# EAGLE design Volume Button LED 5 (EAGLE 7.3.0)

## Sheet 1 of 2
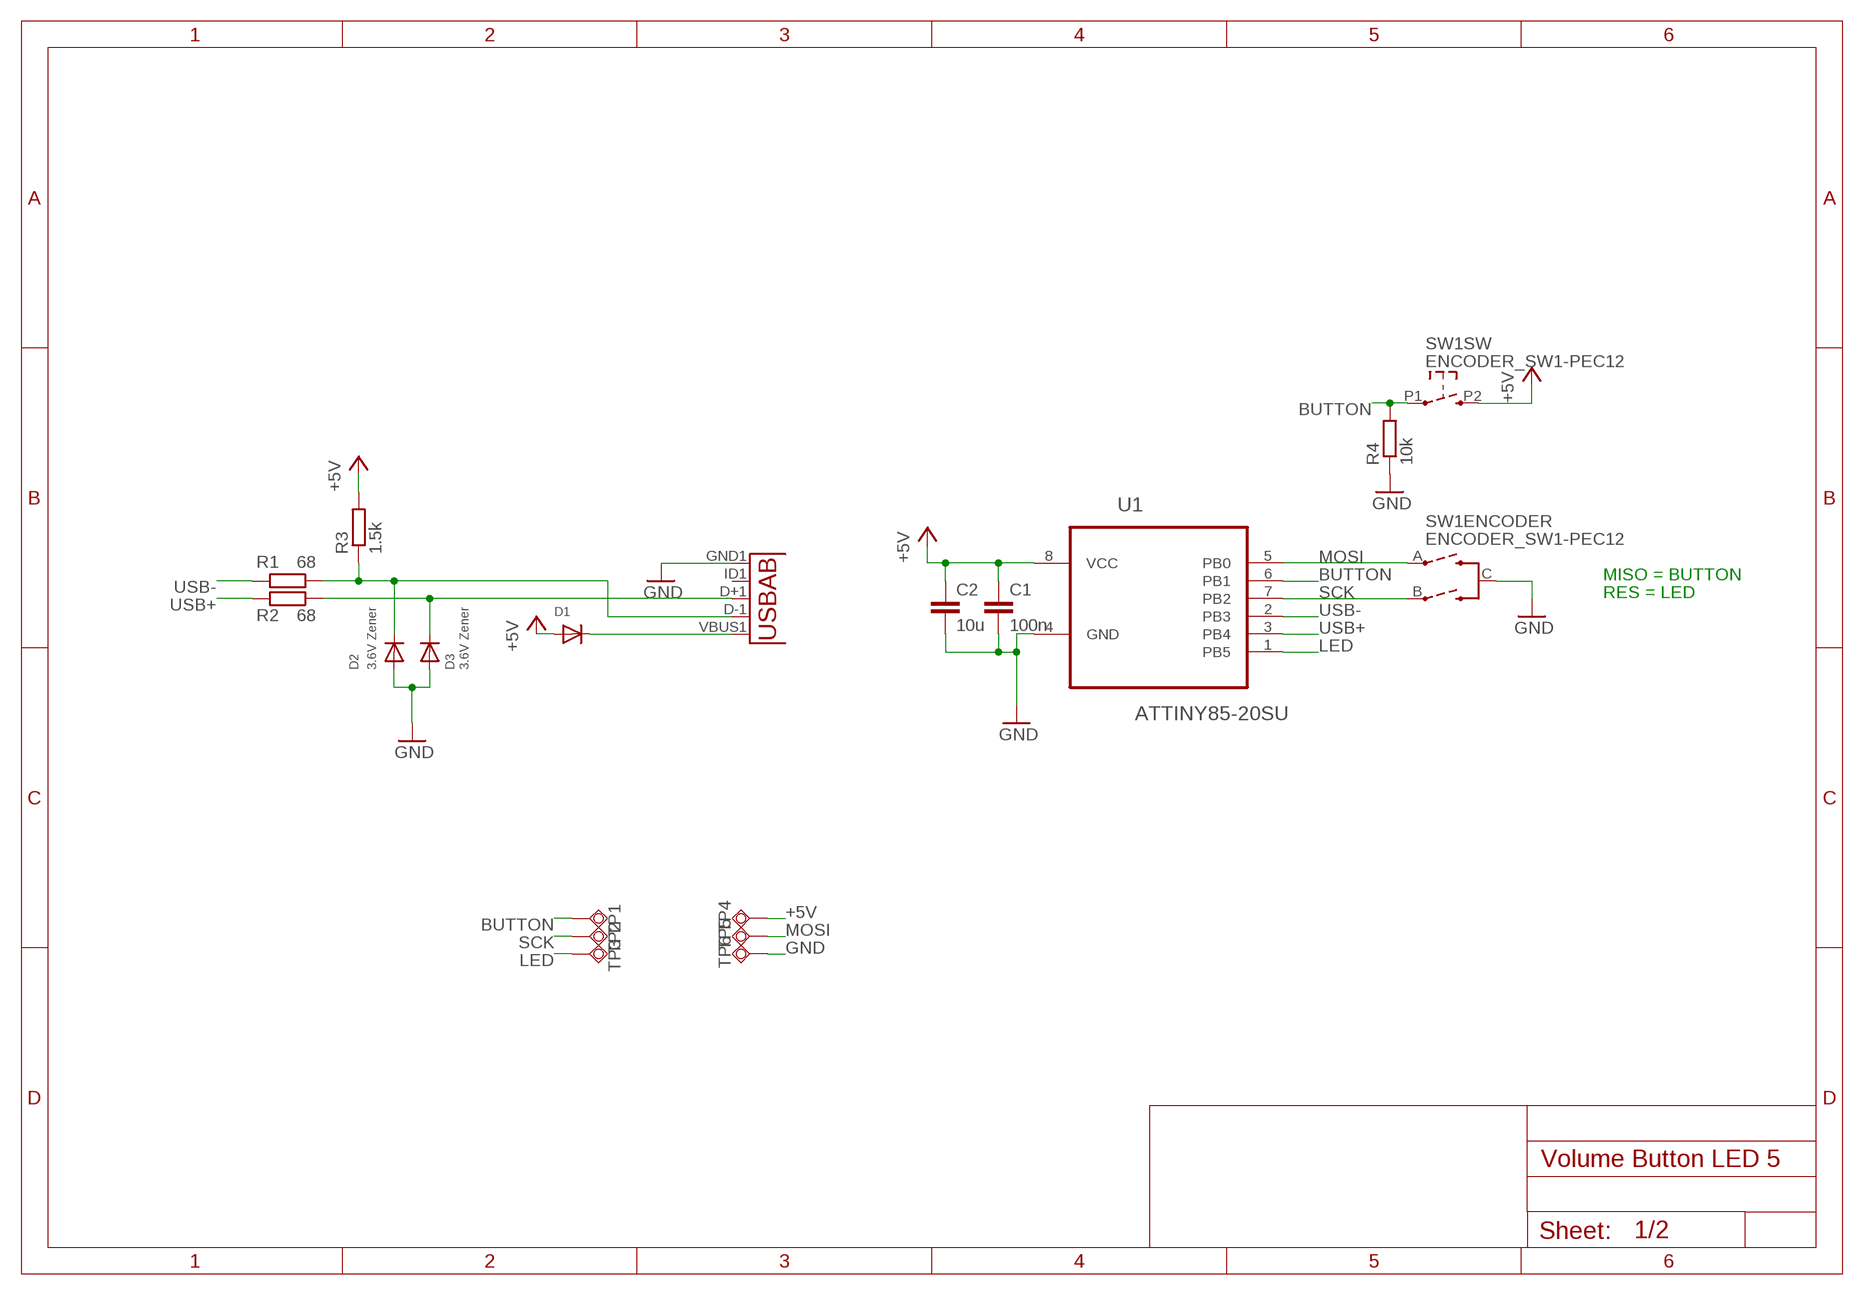
[diagram p0: schematic, sheet 1]

### Parts
C1  100n  C-EUC0805  [C0805]
C2  10u  C-EUC0805  [C0805]
D1  DIODESOD-123  [SOD-123]
D2  3.6V Zener  DIODESOD-323F  [SOD-323F]
D3  3.6V Zener  DIODESOD-323F  [SOD-323F]
R1  68  R-EU_R0603  [R0603]
R2  68  R-EU_R0603  [R0603]
R3  1.5k  R-EU_R0603  [R0603]
R4  10k  R-EU_R0805  [R0805]
SW1  ENCODER_SW1-PEC12  [PEC12_INCREMENTAL_ENCODER]
TP1  TPSQTP15R  [TP15R]
TP2  TPSQTP15R  [TP15R]
TP3  TPSQTP15R  [TP15R]
TP4  TPSQTP15R  [TP15R]
TP5  TPSQTP15R  [TP15R]
TP6  TPSQTP15R  [TP15R]
U1  ATTINY85-20SU  [SOIC127P798X216-8N]
U2  USB""  [USB-MICRO-SMD]

### Nets
+5V: C1.1 C2.1 D1.A R3.2 SW1.P2 TP4.TP U1.8(VCC) ; also sheet 2
BUTTON: R4.2 SW1.P1 TP1.TP U1.6(PB1)
GND: C1.2 C2.2 D2.A D3.A R4.1 SW1.C(ENCODER:C) TP6.TP U1.4(GND) U2.GND1(GND) ; also sheet 2
LED: TP3.TP U1.1(PB5) ; also sheet 2
MOSI: SW1.A(ENCODER:A) TP5.TP U1.5(PB0)
N$2: D1.C U2.VBUS1(VBUS)
N$3: D2.C R1.1 R3.1 U2.D-1(D-)
N$4: D3.C R2.1 U2.D+1(D+)
SCK: SW1.B(ENCODER:B) TP2.TP U1.7(PB2)
USB+: R2.2 U1.3(PB4)
USB-: R1.2 U1.2(PB3)
Unconnected: U2.ID1(USBID)

### Notes on the sheet
- MISO = BUTTON
- RES = LED

## Sheet 2 of 2
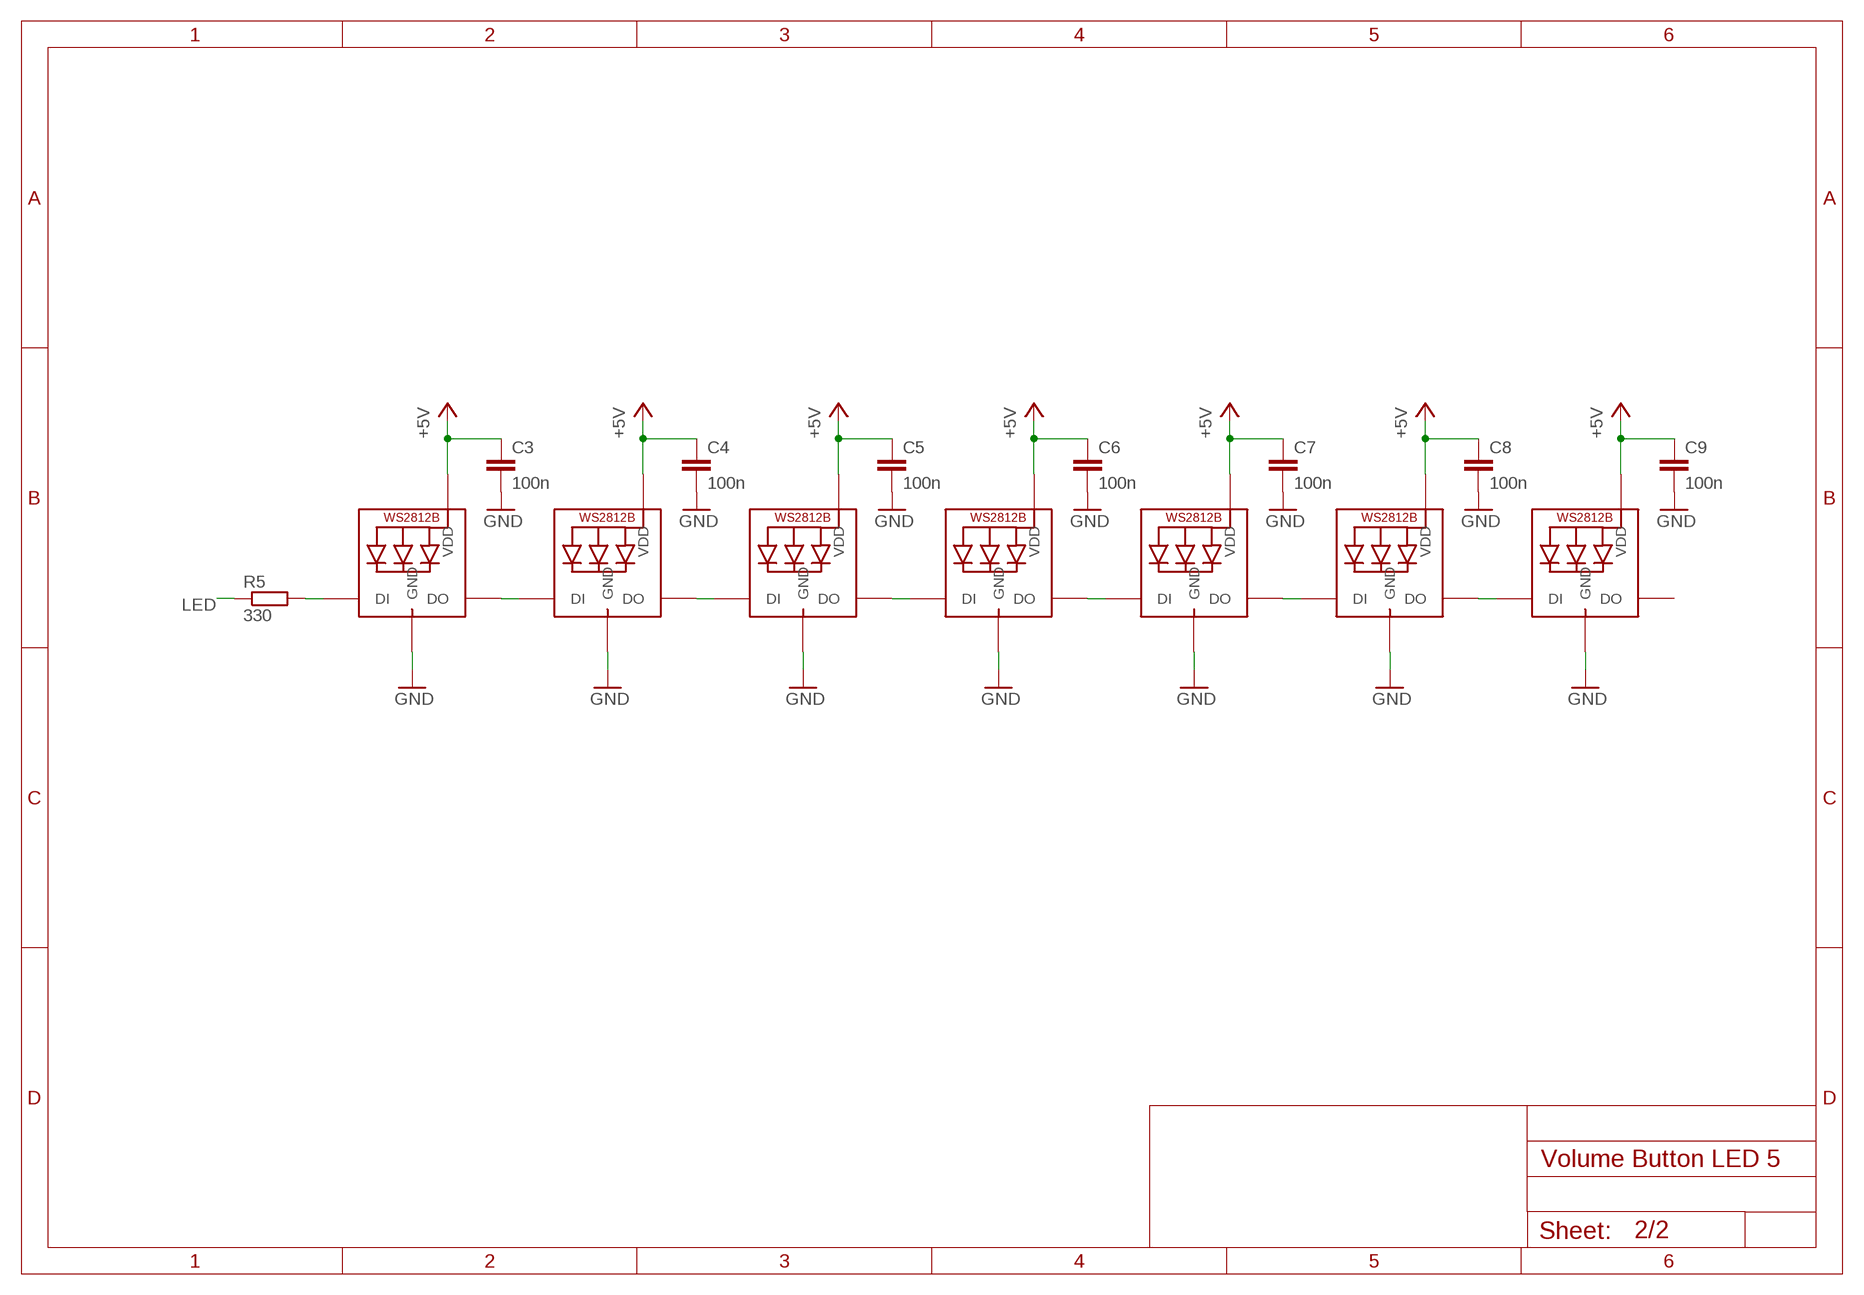
[diagram p1: schematic, sheet 2]

### Parts
C3  100n  C-EUC0805  [C0805]
C4  100n  C-EUC0805  [C0805]
C5  100n  C-EUC0805  [C0805]
C6  100n  C-EUC0805  [C0805]
C7  100n  C-EUC0805  [C0805]
C8  100n  C-EUC0805  [C0805]
C9  100n  C-EUC0805  [C0805]
LED1  WS2812B5050  [WS2812B]
LED2  WS2812B5050  [WS2812B]
LED3  WS2812B5050  [WS2812B]
LED4  WS2812B5050  [WS2812B]
LED5  WS2812B5050  [WS2812B]
LED6  WS2812B5050  [WS2812B]
LED7  WS2812B5050  [WS2812B]
R5  330  R-EU_R0805  [R0805]

### Nets
+5V: C3.1 C4.1 C5.1 C6.1 C7.1 C8.1 C9.1 LED1.1-VDD(VDD) LED2.1-VDD(VDD) LED3.1-VDD(VDD) LED4.1-VDD(VDD) LED5.1-VDD(VDD) LED6.1-VDD(VDD) LED7.1-VDD(VDD) ; also sheet 1
GND: C3.2 C4.2 C5.2 C6.2 C7.2 C8.2 C9.2 LED1.3-GND(GND) LED2.3-GND(GND) LED3.3-GND(GND) LED4.3-GND(GND) LED5.3-GND(GND) LED6.3-GND(GND) LED7.3-GND(GND) ; also sheet 1
LED: R5.1 ; also sheet 1
N$1: LED1.2-DOUT(DO) LED2.4-DIN(DI)
N$5: LED1.4-DIN(DI) R5.2
N$7: LED2.2-DOUT(DO) LED3.4-DIN(DI)
N$8: LED3.2-DOUT(DO) LED4.4-DIN(DI)
N$9: LED4.2-DOUT(DO) LED5.4-DIN(DI)
N$10: LED5.2-DOUT(DO) LED6.4-DIN(DI)
N$12: LED6.2-DOUT(DO) LED7.4-DIN(DI)
Unconnected: LED7.2-DOUT(DO)

## Library data of the parts
C1-C9 = rcl:C-EU: CAPACITOR, European symbol
D1-D3 = adafruit:DIODE: Diode SMADIODE - SMA Surface Mount Package 20V 1A Schottky Diode Digikey: 641-1014-6-ND DO-1N4148 - Through Hole Small Current Diode SOD-123 20V 1 A (.5mV Vf) Schottky Diode - Digikey: MBRX120TPMSCT-ND SOD-323 10V 570mA (.38mV Vf, 3ns) Schottky Diode - Digikey: ZLLS410CT-ND SOD-523 30V 30mA Schottky Diode (RB751S-40TE61) - Digikey: RB751S-40TE61CT-ND SOT23-R/W - SOT23 Package (R = Solder Paste/Reflow Ovens, W = Hand-Soldering) BAT54Film 40V 300mA - Digikey: 497-7162-1-ND
LED1-LED7 = adafruit:WS2812B
R1-R5 = rcl:R-EU_: RESISTOR, European symbol
SW1 = dp_devices:ENCODER_SW1: Incremental Encoder with push switch
TP1-TP6 = testpad:TPSQ: Test pad
U1 = ATTINY85:ATTINY85-20SU: 8-bit Microcontroller with In-System Programmable Flash; MPN: ATTINY85-20SU; OC_FARNELL: 1455164; OC_NEWARK: 58M3797; PACKAGE: SOIC-8; SUPPLIER: Atmel
U2 = MicroUSB:USB: This is a USB AB connector that is compatible with USB OTG. i.e. this connector can serve as a host or device

## Board
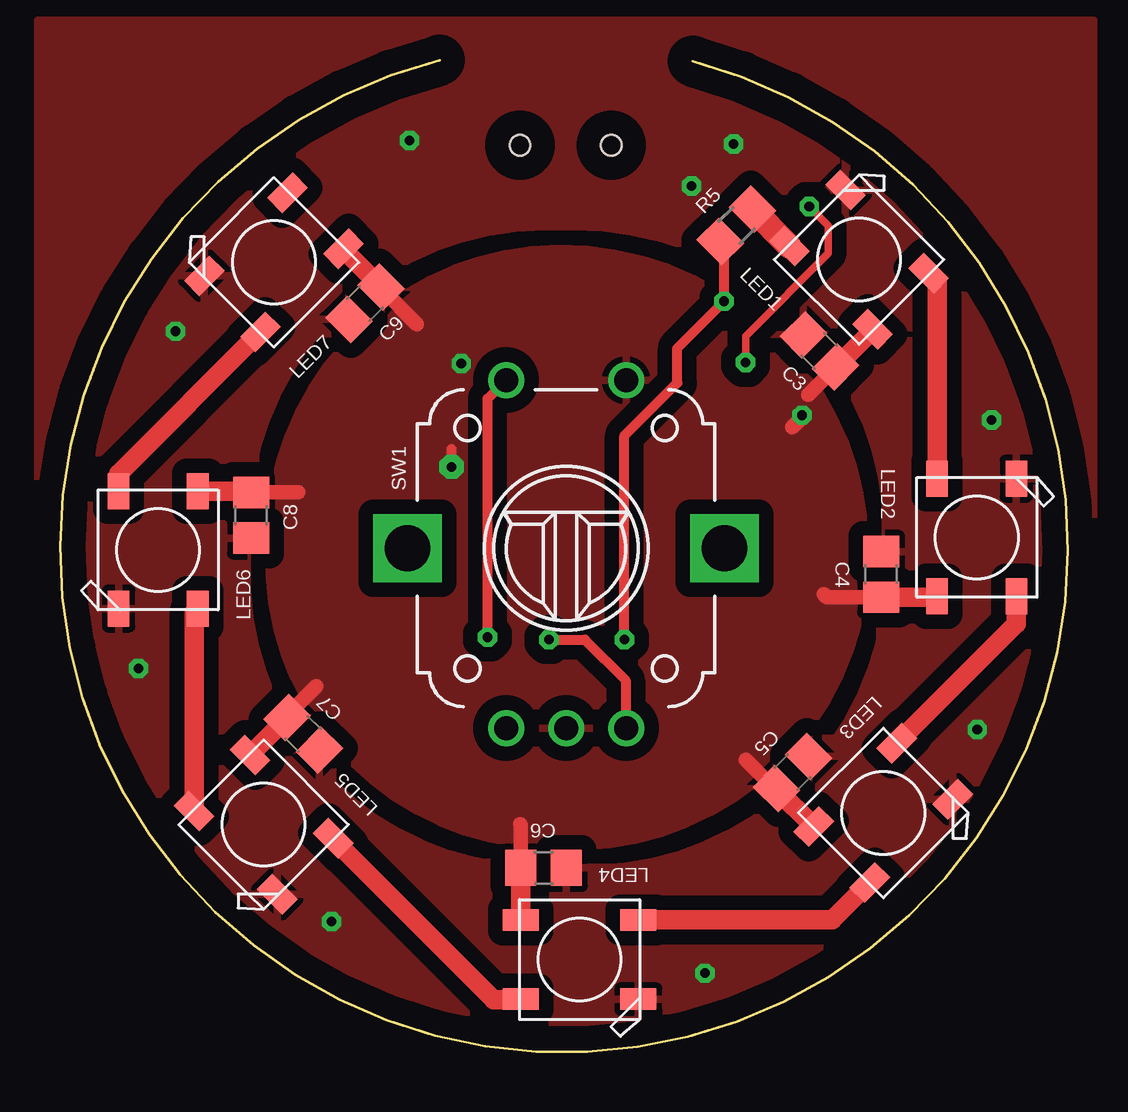
[diagram p2: board, top side]
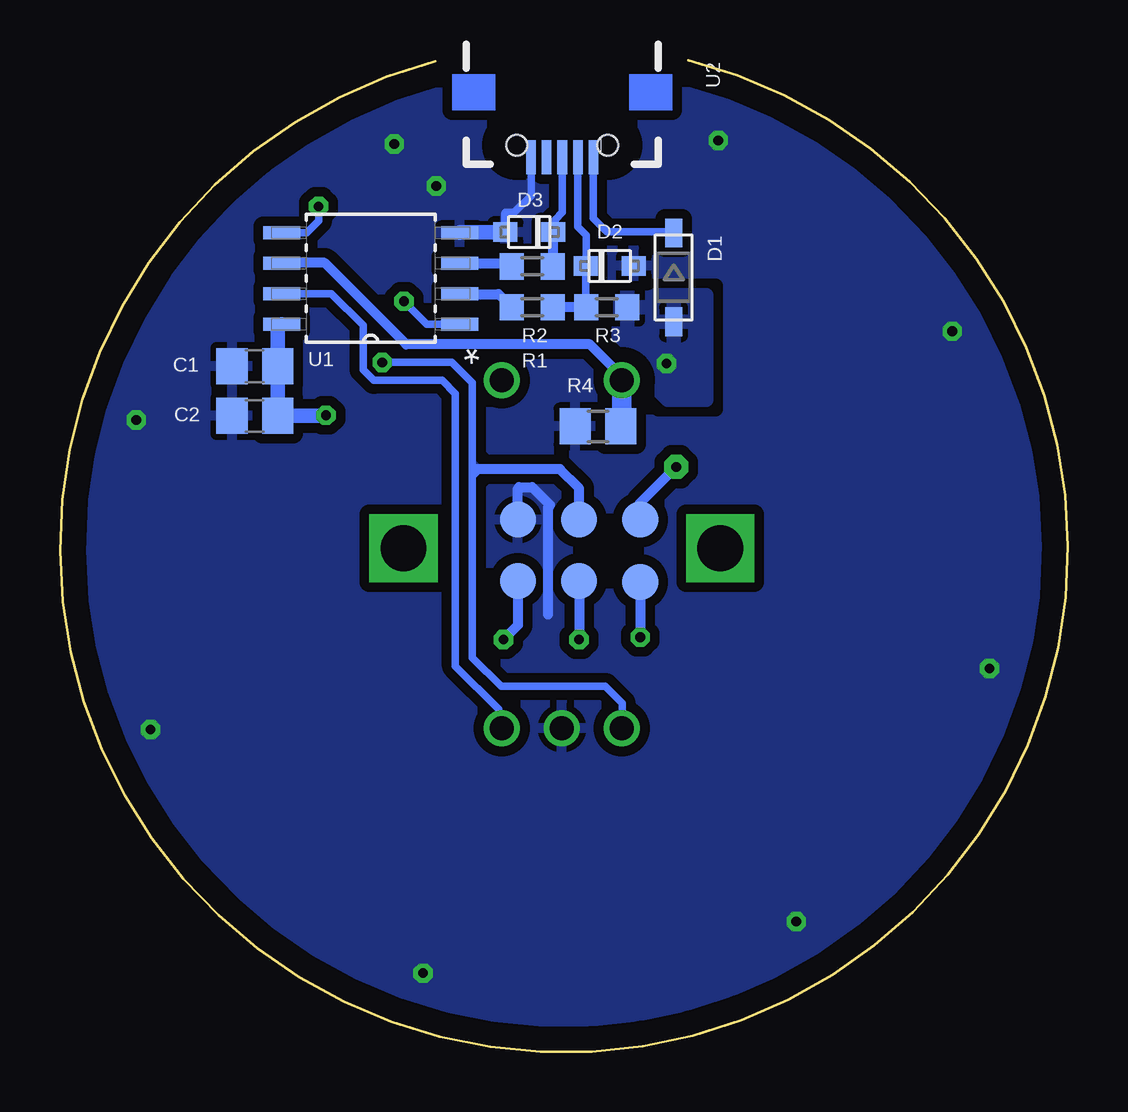
[diagram p3: board, bottom side, seen from below]

Size 42 x 41.33 mm. Coordinates in mm from the lower left corner, seen from the top.
Outline: 26.37,41.28 arc-331 15.82,41.33
Copper layers (1*16): Top 0.035mm / dielectric 1.5mm / Bottom 0.035mm
Design rules "default": minimum track width 10mil, minimum drill 24mil, track to track 8mil, track to pad 8mil, pad to pad 8mil, via to via 8mil, smd to smd 8mil, copper to edge 40mil, drill to drill 8mil, minimum pad ring 10mil, minimum via ring 8mil, stop-mask expansion 4mil, vias tented up to drill 0mil, thermal gap 10mil

### Footprints (pad centres in the part's own frame; a part is rotated, then mirrored left to right if it is on the bottom)
C0805 = smd 1.3 x 1.5: 1 -0.95,0; 2 0.95,0
SOD-123 = smd 1.2 x 0.7: A 1.85,0; C -1.85,0
SOD-323F = smd 1 x 0.8: A -1,0; C 1,0
WS2812B = smd 1.5 x 0.9: 1-VDD 2.45,-1.65; 2-DOUT 2.45,1.65; 3-GND -2.45,1.65; 4-DIN -2.45,-1.65
R0603 = smd 1 x 1.1: 1 -0.85,0; 2 0.85,0
R0805 = smd 1.3 x 1.5: 1 -0.95,0; 2 0.95,0
PEC12_INCREMENTAL_ENCODER = drill 1: A -2.5,-7.5; B 2.5,-7.5; C 0,-7.5; P1 -2.5,7; P2 2.5,7 | drill 1.9 square: GND@1 -6.6,0; GND@2 6.6,0
TP15R = smd 1.5 x 1.5: TP 0,0
SOIC127P798X216-8N = smd 1.549 x 0.533: 1 -3.708,1.905; 2 -3.708,0.635; 3 -3.708,-0.635; 4 -3.708,-1.905; 5 3.708,-1.905; 6 3.708,-0.635; 7 3.708,0.635; 8 3.708,1.905
USB-MICRO-SMD = smd 1.4 x 0.4: D+1 2.7,0; D-1 2.7,0.65; GND1 2.7,-1.3; ID1 2.7,-0.65; VBUS1 2.7,1.3 | hole 0.85: 2.2,1.9; 2.2,-1.9

### Placement (x,y rotation side)
C1  33.88,28.57 180 bottom
C2  33.88,26.5 180 bottom
C3  31.65,29.21 135 top
C4  34.21,19.9 90 top
C5  30.52,11.64 45 top
C6  20.15,7.67 0 top
C7  10.13,13.25 315 top
C8  7.96,22.36 270 top
C9  12.71,31.19 225 top
D1  16.43,32.27 270 bottom
D2  19.09,32.75 180 bottom
D3  22.44,34.16 0 bottom
LED1  33.29,33.01 315 top
LED2  38.2,21.44 270 top
LED3  34.3,9.96 225 top
LED4  21.65,3.85 180 top
LED5  8.48,9.47 135 top
LED6  4.09,20.92 90 top
LED7  8.92,32.9 45 top
R1  22.32,31.03 180 bottom
R2  22.32,32.73 180 bottom
R3  19.22,31.03 0 bottom
R4  19.58,26.06 0 bottom
R5  28.18,34.44 45 top
SW1  21.09,20.98 0 top
TP1  17.82,19.58 0 bottom
TP2  20.37,19.63 0 bottom
TP3  22.92,19.63 0 bottom
TP4  17.82,22.18 0 bottom
TP5  20.37,22.18 0 bottom
TP6  22.92,22.18 0 bottom
U1  29.05,32.23 180 bottom
U2  21.07,39.98 270 bottom

### Tracks (layer width: path | path; a pad name or v marks a point on that pad's centre or on a via)
+5V  (via drill 0.4 pad 0.41, 0.4 pad 1.02)
  Top 0.406: v16.32,24.38 16.32,25.13
  Top 0.61: v30.92,26.53 30.92,26.43 30.52,26.03 | C3.1 31.17,27.38 | C4.1 31.95,18.95 31.82,19.08 | C5.1 29.78,10.96 28.57,12.18 | C6.1 19.2,9.45 19.17,9.48 | C7.1 9.46,14.02 10.67,15.23 | C8.1 9.9,23.31 9.92,23.33 | C9.1 13.38,31.81 14.87,30.33
  Top 0.813: LED7.1-VDD 11.81,33.43 C9.1 | LED6.1-VDD 7.9,23.37 C8.1 | LED5.1-VDD 7.92,12.39 C7.1 | C6.1 LED4.1-VDD | C5.1 29.85,10.95 LED3.1-VDD | C4.1 36.51,18.95 LED2.1-VDD | LED1.1-VDD 33.86,30.07 C3.1
  Bottom 0.406: TP4.TP 17.82,22.88 v16.32,24.38
  Bottom 0.61: 32.76,28.74 C1.1 | C1.1 C2.1 30.95,26.5 v30.92,26.53 | C1.1 32.93,30.15 U1.8
  Bottom 0.813: C1.1
  other vias: 16.72,28.68
  pour Bottom (isolate 0.61): 15.07,31.53 15.07,27.18 16.67,27.18 19.07,29.58 19.07,31.53
  pour Top (isolate 0.61): 20.77,33.48 arc-90 33.57,20.93 33.57,19.93 arc-90 20.62,8.58 20.07,8.58 arc-90 8.72,20.93 8.72,21.28 arc-90
BUTTON  (via drill 0.4 pad 0.41)
  Top 0.406: v17.82,17.28 17.82,27.22 SW1.P1
  Bottom 0.406: TP1.TP v17.82,17.28 | SW1.P1 18.59,28.14 19.92,29.48 27.57,29.48 30.97,32.88 32.74,32.88 U1.6
  Bottom 0.813: SW1.P1 18.59,26.1 R4.2
GND  (via drill 0.4 pad 0.41)
  Bottom 0.305: U2.GND1 22.37,35.68 23.07,34.98 23.42,34.98 23.47,34.93 23.47,34.19 D3.A
  Bottom 0.406: TP6.TP 22.92,23.48 22.87,23.53 22.32,23.53 21.57,22.78 21.67,22.68 21.67,18.23
  Bottom 0.61: D3.A 25.32,34.16 U1.4
  other vias: 4.82,30.03 3.27,15.98 11.32,5.43 26.87,3.28 38.22,13.43 38.82,26.33 14.57,37.98 28.07,37.83 26.32,36.08
  pour Bottom (isolate 0.406, rank 6): -0.93,42.98 -0.93,-1.02 43.07,-1.02 43.07,42.98
  pour Top (isolate 0.61, rank 6): -0.93,42.98 -0.93,-1.02 43.07,-1.02 43.07,42.98
LED  (via drill 0.4 pad 0.41)
  Top 0.406: v23.52,17.18 23.52,25.68 25.72,27.88 25.72,29.33 v27.67,31.28 27.67,33.61 R5.1
  Bottom 0.305: U1.1 26.72,30.33 v27.67,31.28
  Bottom 0.406: U1.1 | TP3.TP 22.92,17.78 v23.52,17.18
MOSI  (via drill 0.4 pad 0.41)
  Top 0.305: v28.57,28.73 28.57,29.83 32.02,33.28 32.02,34.43 v31.22,35.23
  Bottom 0.305: 24.82,23.98 24.82,27.88 25.67,28.73 v28.57,28.73 | 24.82,23.98 24.82,16.43 23.62,15.23 19.27,15.23 18.57,14.53 18.57,13.5 SW1.A | 24.52,24.28 24.82,23.98 | v31.22,35.23 31.22,34.63 31.72,34.13 U1.5
  Bottom 0.406: TP5.TP 20.37,23.48 21.17,24.28 24.52,24.28 24.77,24.28
  pour Bottom: 24.52,24.28 24.82,24.58 24.82,23.98
N$1
  Top 0.813: LED2.4-DIN 36.55,32.08 LED1.2-DOUT
N$2
  Bottom 0.305: D1.C 16.49,34.18 19.22,34.18 19.77,34.73 U2.VBUS1
N$3
  Bottom 0.305: R3.1 20.09,31.05 D2.C 20.07,32.92 20.07,34.03 20.42,34.38 U2.D-1
  Bottom 0.406: R3.1 R1.1
N$4
  Bottom 0.305: D3.C 21.37,34.23 21.37,34.68 21.07,34.98 U2.D+1
  Bottom 0.406: D3.C 21.47,34.16 R2.1
N$5
  Top 0.305: R5.2
  Top 1.016: R5.2 LED1.4-DIN
N$7
  Top 0.813: LED2.2-DOUT 39.85,17.84 LED3.4-DIN
N$8
  Top 0.813: LED4.4-DIN 32.18,5.5 LED3.2-DOUT
N$9
  Top 0.813: LED5.4-DIN 11.38,8.86 18.07,2.18 19.18,2.18 LED4.2-DOUT
N$10
  Top 0.813: LED5.2-DOUT 5.59,18.31 LED6.4-DIN
N$12
  Top 0.813: LED6.2-DOUT 2.44,24.09 LED7.4-DIN
SCK  (via drill 0.4 pad 0.41)
  Top 0.406: v20.37,17.18 21.87,17.18 23.57,15.48 23.57,13.5 SW1.B
  Bottom 0.305: U1.7 30.68,31.59 29.37,30.28 29.37,28.43 28.92,27.98 26.07,27.98 25.52,27.43 25.52,16.08 23.72,14.28 23.72,13.62 SW1.B 23.57,13.5
  Bottom 0.406: TP2.TP v20.37,17.18
USB+
  Bottom 0.305: 25.33,32.88 U1.3
  Bottom 0.406: U1.3 23.17,32.86 R2.2
USB-
  Bottom 0.305: 25.33,31.58 U1.2
  Bottom 0.406: 25.33,31.58 23.72,31.58 R1.2